# Altium project RemoteControl.PrjPCB
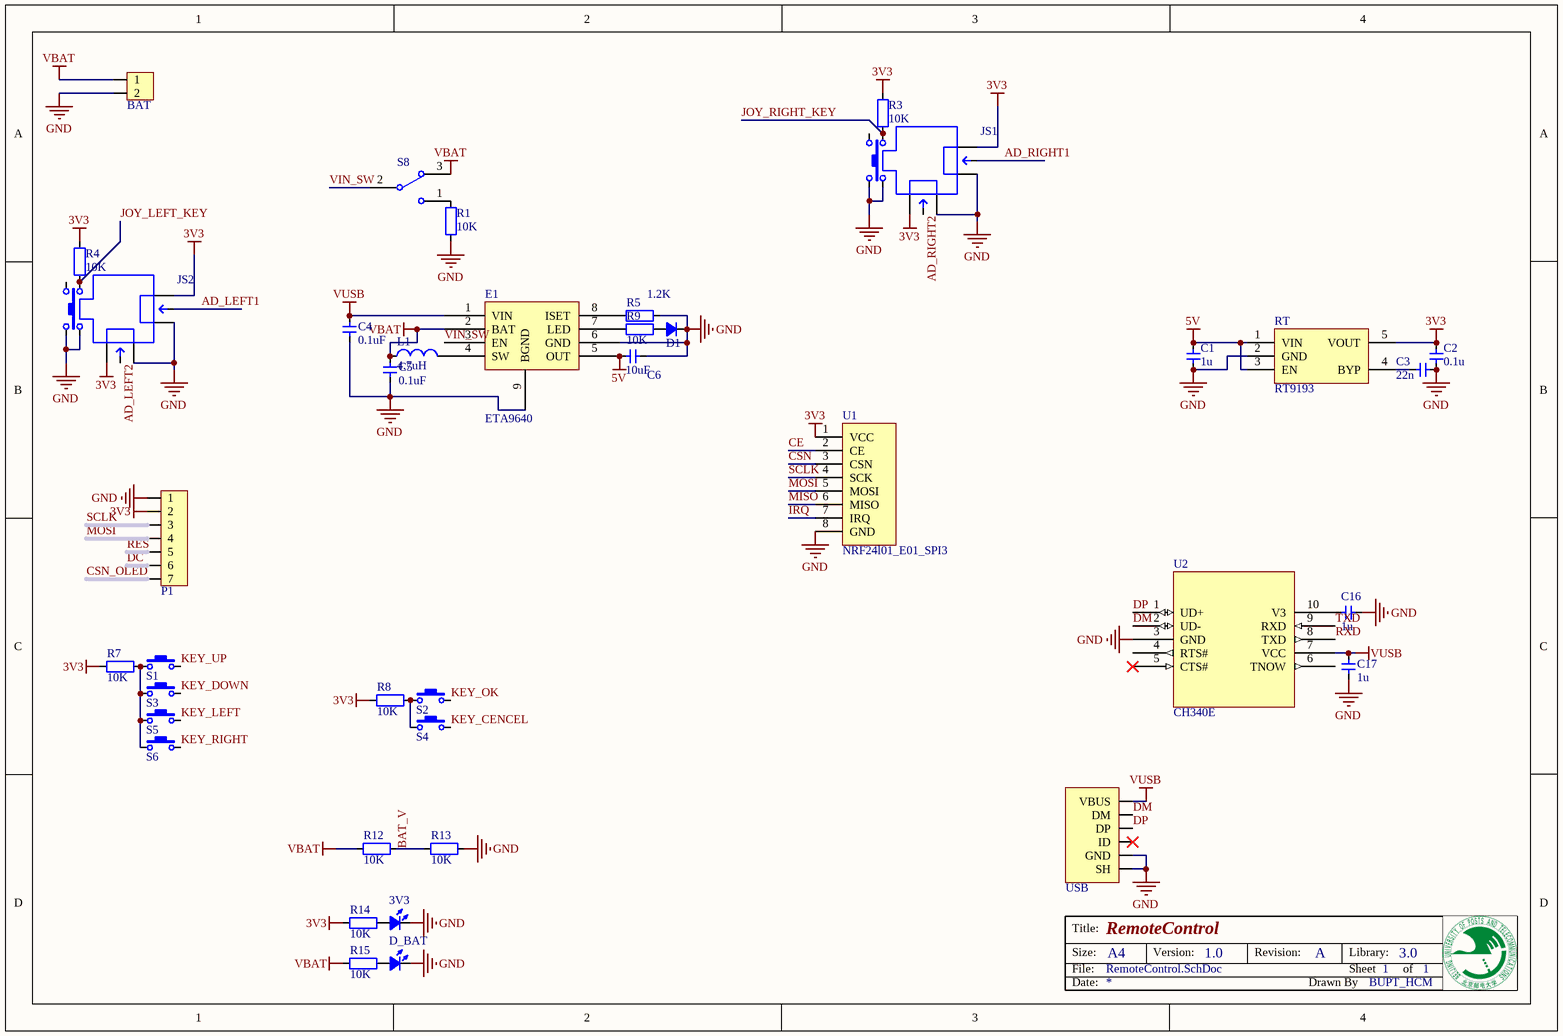
[diagram p0: RemoteControl.SchDoc]
3 sheets, 60 parts. Net scope: global (net labels, ports and power ports of the same name join across sheets).
Board file: RemoteControl.PcbDoc
Sheets:
  RemoteControl.SchDoc
  NRF.SchDoc
  Core.SchDoc

## Sheet RemoteControl.SchDoc: RemoteControl
size A4; CompanyName: BUPT; DrawnBy: BUPT_HCM; Engineer: BUPT_HCM; Organization: BUPT_Robot; Revision: A; SheetNumber: 1; SheetTotal: 1; Version: 1.0; LibVersion: 3.0

### Parts
3V3  LED_0805  [LED_0805_RED]  (value not drawn)
BAT  HDR1x2_2.54  [HDR1X2_2.54_90]  (value not drawn)
C1  value 1u  [CAP_0603]  (hidden comment: Cap_0603)
C2  value 0.1u  [CAP_0603]  (hidden comment: Cap_0603)
C3  value 22n  [CAP_0603]  (hidden comment: Cap_0603)
C4  value 0.1uF  [CAP_0603]  (hidden comment: Cap_0603)
C5  value 0.1uF  [CAP_0603]  (hidden comment: Cap_0603)
C6  value 10uF  [CAP_0603]  (hidden comment: Cap_0603)
C16  value 1u  [CAP_0603]  (hidden comment: Cap_0603)
C17  value 1u  [CAP_0603]  (hidden comment: Cap_0603)
D1  D_0805  [LED_0805_YELLOW]  (value not drawn)
D_BAT  LED_0805  [LED_0805_RED]  (value not drawn)
E1  ETA9640  [SOP_E150_8 -with_PADs]
JS1  JoyStick  [JoyStick]  (value not drawn)
JS2  JoyStick  [JoyStick]  (value not drawn)
L1  value 4.7uH  [IND_CD32]  (hidden comment: Ind_CD32)
P1  HDR1x7_2.54  [HDR1X7_2.54_180]  (value not drawn)
R1  value 10K  [RES_0603]  (hidden comment: Res_0603)
R3  value 10K  [RES_0603]  (hidden comment: Res_0603)
R4  value 10K  [RES_0603]  (hidden comment: Res_0603)
R5  value 1.2K  [RES_0603]  (hidden comment: Res_0603)
R7  value 10K  [RES_0603]  (hidden comment: Res_0603)
R8  value 10K  [RES_0603]  (hidden comment: Res_0603)
R9  value 10K  [RES_0603]  (hidden comment: Res_0603)
R12  value 10K  [RES_0603]  (hidden comment: Res_0603)
R13  value 10K  [RES_0603]  (hidden comment: Res_0603)
R14  value 10K  [RES_0603]  (hidden comment: Res_0603)
R15  value 10K  [RES_0603]  (hidden comment: Res_0603)
RT  RT9193  [SOT23-5]
S1  ButtonTACT_3x6x2.5_180  [ButtonTACT_3x6x2.5_180]  (value not drawn)
S2  ButtonTACT_3x6x2.5_180  [ButtonTACT_3x6x2.5_180]  (value not drawn)
S3  ButtonTACT_3x6x2.5_180  [ButtonTACT_3x6x2.5_180]  (value not drawn)
S4  ButtonTACT_3x6x2.5_180  [ButtonTACT_3x6x2.5_180]  (value not drawn)
S5  ButtonTACT_3x6x2.5_180  [ButtonTACT_3x6x2.5_180]  (value not drawn)
S6  ButtonTACT_3x6x2.5_180  [ButtonTACT_3x6x2.5_180]  (value not drawn)
S8  SwitchSPDT_2.8x6.6_90  [SwitchSPDT_2.8X6.6_90]  (value not drawn)
U1  NRF24l01_E01_SPI3  [E01-ML01SP2]
U2  CH340E  [MSOP10]
USB  USB_Micro  [USB_Micro-AB]  (value not drawn)

### Nets
3V3: C2.2 JS1.1 JS1.6 JS2.1 JS2.6 P1.2 R3.2 R4.2 R7.2 R8.2 R14.1 RT.5(VOUT) U1.1(VCC)
5V: C1.2 C6.1 E1.5(OUT) RT.1(VIN) RT.3(EN)
GND: 3V3.2(K) BAT.2 C1.1 C2.1 C3.1 C4.2 C5.2 C6.2 C16.1 C17.2 D1.2(K) D_BAT.2(K) E1.6(GND) E1.9(BGND) JS1.3 JS1.4 JS1.8 JS1.10 JS2.3 JS2.4 JS2.8 JS2.10 P1.1 R1.1 R5.1 R13.1 RT.2(GND) U1.8(GND) U2.3(GND) USB.0(SH) USB.5(GND)
VBAT: BAT.1 C5.1 E1.2(BAT) L1.1 R12.2 R15.1 S8.3
VUSB: C4.1 C17.1 E1.1(VIN) U2.7(VCC) USB.1(VBUS)
AD_LEFT1: JS2.5
AD_LEFT2: JS2.2
AD_RIGHT1: JS1.5
AD_RIGHT2: JS1.2
BAT_V: R12.1 R13.2
CE: U1.2(CE)
CSN: U1.3(CSN)
CSN_OLED: P1.7
DC: P1.6
DM: U2.2(UD-) USB.2(DM)
DP: U2.1(UD+) USB.3(DP)
IRQ: U1.7(IRQ)
JOY_LEFT_KEY: JS2.9 R4.1
JOY_RIGHT_KEY: JS1.9 R3.1
KEY_CENCEL: S4.2
KEY_DOWN: S3.2
KEY_LEFT: S5.2
KEY_OK: S2.2
KEY_RIGHT: S6.2
KEY_UP: S1.2
MISO: U1.6(MISO)
MOSI: P1.4 U1.5(MOSI)
RES: P1.5
RXD: U2.8(TXD)
SCLK: P1.3 U1.4(SCK)
TXD: U2.9(RXD)
VIN_SW: E1.3(EN) S8.2
Net3V3_1: 3V3.1(A) R14.2
NetC3_2: C3.2 RT.4(BYP)
NetC16_2: C16.2 U2.10(V3)
NetD1_1: D1.1(A) R9.1
NetD_BAT_1: D_BAT.1(A) R15.2
NetE1_4: E1.4(SW) L1.2
NetE1_7: E1.7(LED) R9.2
NetE1_8: E1.8(ISET) R5.2
NetR1_2: R1.2 S8.1
NetR7_1: R7.1 S1.1 S3.1 S5.1 S6.1
NetR8_1: R8.1 S2.1 S4.1

Not connected (* = marked no-connect by the designer): JS1 7; JS2 7; U2 4(RTS#) 5(CTS#)* 6(TNOW); USB 4(ID)*

### Notes on the sheet
- Title:
- Size:
- Date:
- File:
- A4
- Version:
- Revision:
- Drawn By
- Sheet
- Library:
- of

### Library data of the parts
3V3 D_BAT = LED_0805: LED
BAT = HDR1x2_2.54: Header
C1-C6 C16 C17 = Cap_0603: Capacitor
L1 = Ind_CD32: Inductor
P1 = HDR1x7_2.54T: Header
R1 R3-R5 R7-R9 R12-R15 = Res_0603: Resistor
RT = RT9193: Power
S1-S6 = ButtonTACT_3x6x2.5_180: Button
S8 = SwitchSPDT_2.8x6.6_90: Switch
U1 = NRF24l01_E01_SPI2
U2 = CH340E: USB to TTL Serial / UART
USB = USB_Micro: USB

## Sheet NRF.SchDoc
size A4

## Sheet Core.SchDoc
size A4
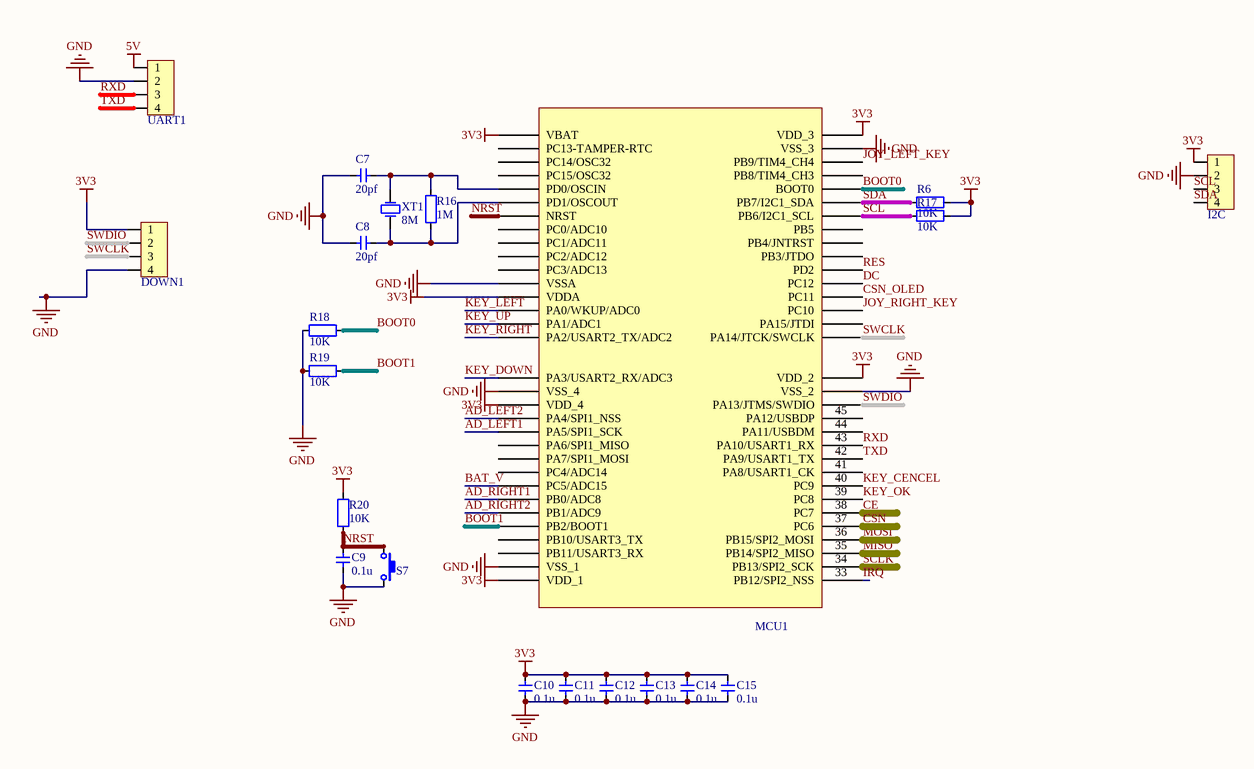
[diagram p1: Core.SchDoc]

### Parts
C7  value 20pf  [CAP_0603]  (hidden comment: Cap_0603)
C8  value 20pf  [CAP_0603]  (hidden comment: Cap_0603)
C9  value 0.1u  [CAP_0603]  (hidden comment: Cap_0603)
C10  value 0.1u  [CAP_0603]  (hidden comment: Cap_0603)
C11  value 0.1u  [CAP_0603]  (hidden comment: Cap_0603)
C12  value 0.1u  [CAP_0603]  (hidden comment: Cap_0603)
C13  value 0.1u  [CAP_0603]  (hidden comment: Cap_0603)
C14  value 0.1u  [CAP_0603]  (hidden comment: Cap_0603)
C15  value 0.1u  [CAP_0603]  (hidden comment: Cap_0603)
DOWN1  HDR1x4_2.54  [HDR1x4_2.54_180]  (value not drawn)
I2C  HDR1x4_2.54  [HDR1x4_2.54_180]  (value not drawn)
MCU1  STM32F103RC  [LQFP_P0.5_64]  (value not drawn)
R6  value 10K  [RES_0603]  (hidden comment: Res_0603)
R16  value 1M  [RES_0603]  (hidden comment: Res_0603)
R17  value 10K  [RES_0603]  (hidden comment: Res_0603)
R18  value 10K  [RES_0603]  (hidden comment: Res_0603)
R19  value 10K  [RES_0603]  (hidden comment: Res_0603)
R20  value 10K  [RES_0603]  (hidden comment: Res_0603)
S7  ButtonTACT_3x4x2_180  [ButtonTACT_3x4x2_180H]  (value not drawn)
UART1  HDR1x4_2.54  [HDR1x4_2.54_180]  (value not drawn)
XT1  value 8M  [XT_5032_2]  (hidden comment: XTAL_5032_2P)

### Nets
3V3: C10.2 C11.2 C12.2 C13.2 C14.2 C15.2 DOWN1.1 I2C.1 MCU1.1(VBAT) MCU1.13(VDDA) MCU1.19(VDD_4) MCU1.32(VDD_1) MCU1.48(VDD_2) MCU1.64(VDD_3) R6.2 R17.2 R20.1
5V: UART1.1
GND: C7.1 C8.1 C9.1 C10.1 C11.1 C12.1 C13.1 C14.1 C15.1 DOWN1.4 I2C.2 MCU1.12(VSSA) MCU1.18(VSS_4) MCU1.31(VSS_1) MCU1.47(VSS_2) MCU1.63(VSS_3) R18.2 R19.2 S7.2 UART1.2
AD_LEFT1: MCU1.21(PA5/SPI1_SCK)
AD_LEFT2: MCU1.20(PA4/SPI1_NSS)
AD_RIGHT1: MCU1.26(PB0/ADC8)
AD_RIGHT2: MCU1.27(PB1/ADC9)
BAT_V: MCU1.25(PC5/ADC15)
BOOT0: MCU1.60(BOOT0) R18.1
BOOT1: MCU1.28(PB2/BOOT1) R19.1
CE: MCU1.38(PC7)
CSN: MCU1.37(PC6)
CSN_OLED: MCU1.52(PC11)
DC: MCU1.53(PC12)
IRQ: MCU1.33(PB12/SPI2_NSS)
JOY_LEFT_KEY: MCU1.62(PB9/TIM4_CH4)
JOY_RIGHT_KEY: MCU1.51(PC10)
KEY_CENCEL: MCU1.40(PC9)
KEY_DOWN: MCU1.17(PA3/USART2_RX/ADC3)
KEY_LEFT: MCU1.14(PA0/WKUP/ADC0)
KEY_OK: MCU1.39(PC8)
KEY_RIGHT: MCU1.16(PA2/USART2_TX/ADC2)
KEY_UP: MCU1.15(PA1/ADC1)
MISO: MCU1.35(PB14/SPI2_MISO)
MOSI: MCU1.36(PB15/SPI2_MOSI)
NRST: C9.2 MCU1.7(NRST) R20.2 S7.1
RES: MCU1.54(PD2)
RXD: MCU1.43(PA10/USART1_RX) UART1.3
SCL: I2C.3 MCU1.58(PB6/I2C1_SCL) R17.1
SCLK: MCU1.34(PB13/SPI2_SCK)
SDA: I2C.4 MCU1.59(PB7/I2C1_SDA) R6.1
SWCLK: DOWN1.3 MCU1.49(PA14/JTCK/SWCLK)
SWDIO: DOWN1.2 MCU1.46(PA13/JTMS/SWDIO)
TXD: MCU1.42(PA9/USART1_TX) UART1.4
NetC7_2: C7.2 MCU1.5(PD0/OSCIN) R16.2 XT1.2(OSC2)
NetC8_2: C8.2 MCU1.6(PD1/OSCOUT) R16.1 XT1.1(OSC1)

Not connected (* = marked no-connect by the designer): MCU1 2(PC13-TAMPER-RTC) 3(PC14/OSC32) 4(PC15/OSC32) 8(PC0/ADC10) 9(PC1/ADC11) 10(PC2/ADC12) 11(PC3/ADC13) 22(PA6/SPI1_MISO) 23(PA7/SPI1_MOSI) 24(PC4/ADC14) 29(PB10/USART3_TX) 30(PB11/USART3_RX) 41(PA8/USART1_CK) 44(PA11/USBDM) 45(PA12/USBDP) 50(PA15/JTDI) 55(PB3/JTDO) 56(PB4/JNTRST) 57(PB5) 61(PB8/TIM4_CH3)

### Library data of the parts
C7-C15 = Cap_0603: Capacitor
DOWN1 I2C UART1 = HDR1x4_2.54: Header
MCU1 = STM32F103RC: MCU
R6 R16-R20 = Res_0603: Resistor
S7 = ButtonTACT_3x4x2_180: Button
XT1 = XTAL_5032_2P: Crystal Oscillator

## Nets that join several sheets
3V3: RemoteControl (13 pins), Core (17 pins)
5V: RemoteControl (5 pins), Core (UART1.1)
GND: RemoteControl (31 pins), Core (20 pins)
AD_LEFT1: RemoteControl (JS2.5), Core (MCU1.21)
AD_LEFT2: RemoteControl (JS2.2), Core (MCU1.20)
AD_RIGHT1: RemoteControl (JS1.5), Core (MCU1.26)
AD_RIGHT2: RemoteControl (JS1.2), Core (MCU1.27)
BAT_V: RemoteControl (R12.1 R13.2), Core (MCU1.25)
CE: RemoteControl (U1.2), Core (MCU1.38)
CSN: RemoteControl (U1.3), Core (MCU1.37)
CSN_OLED: RemoteControl (P1.7), Core (MCU1.52)
DC: RemoteControl (P1.6), Core (MCU1.53)
IRQ: RemoteControl (U1.7), Core (MCU1.33)
JOY_LEFT_KEY: RemoteControl (JS2.9 R4.1), Core (MCU1.62)
JOY_RIGHT_KEY: RemoteControl (JS1.9 R3.1), Core (MCU1.51)
KEY_CENCEL: RemoteControl (S4.2), Core (MCU1.40)
KEY_DOWN: RemoteControl (S3.2), Core (MCU1.17)
KEY_LEFT: RemoteControl (S5.2), Core (MCU1.14)
KEY_OK: RemoteControl (S2.2), Core (MCU1.39)
KEY_RIGHT: RemoteControl (S6.2), Core (MCU1.16)
KEY_UP: RemoteControl (S1.2), Core (MCU1.15)
MISO: RemoteControl (U1.6), Core (MCU1.35)
MOSI: RemoteControl (P1.4 U1.5), Core (MCU1.36)
RES: RemoteControl (P1.5), Core (MCU1.54)
RXD: RemoteControl (U2.8), Core (MCU1.43 UART1.3)
SCLK: RemoteControl (P1.3 U1.4), Core (MCU1.34)
TXD: RemoteControl (U2.9), Core (MCU1.42 UART1.4)